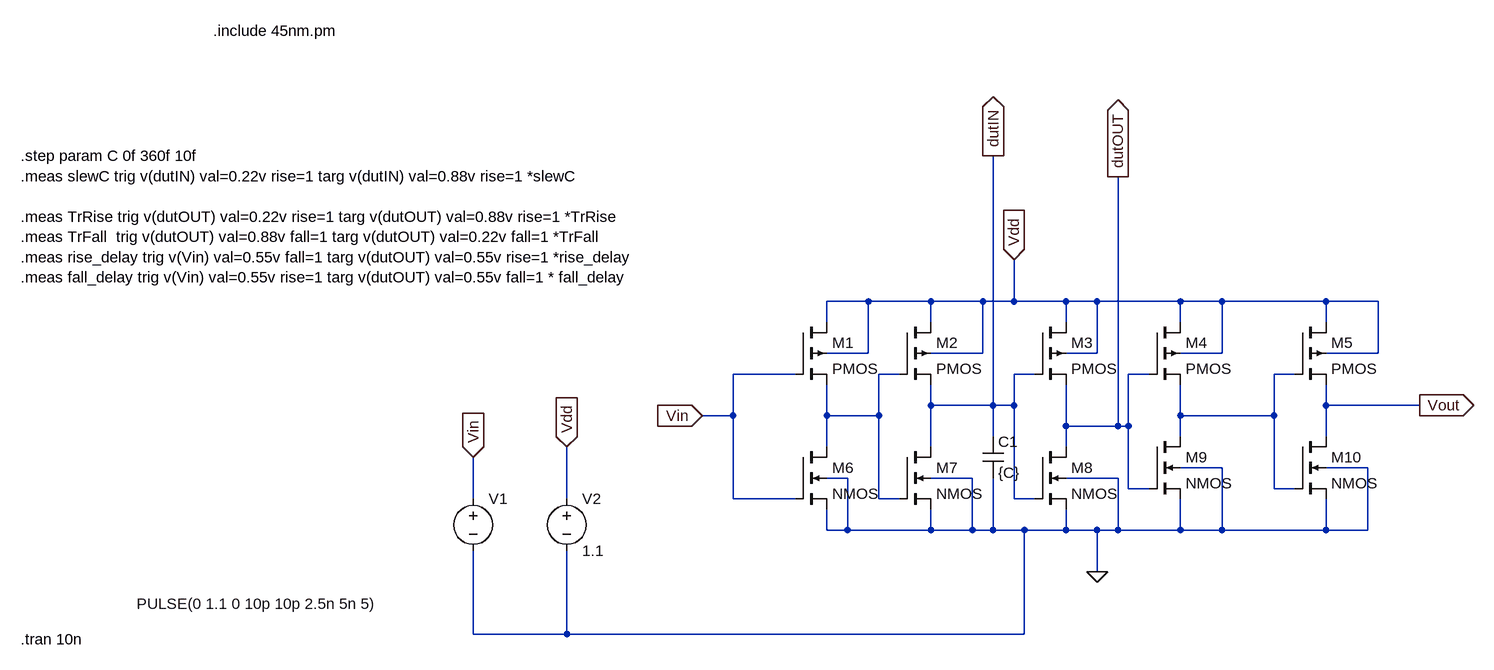
[diagram p0: schematic hw-2-1.asc]
hw-2-1.asc, the LTspice schematic file:
Version 4
SHEET 1 1536 1020
WIRE 576 480 512 480
WIRE 672 480 576 480
WIRE 752 480 672 480
WIRE 800 480 800 416
WIRE 800 480 752 480
WIRE 880 480 800 480
WIRE 928 480 880 480
WIRE 1056 480 928 480
WIRE 1120 480 1056 480
WIRE 1280 480 1120 480
WIRE 1360 480 1280 480
WIRE 512 512 512 480
WIRE 672 512 672 480
WIRE 880 512 880 480
WIRE 1056 512 1056 480
WIRE 1280 512 1280 480
WIRE 576 560 576 480
WIRE 576 560 512 560
WIRE 752 560 752 480
WIRE 752 560 672 560
WIRE 928 560 928 480
WIRE 928 560 880 560
WIRE 1120 560 1120 480
WIRE 1120 560 1056 560
WIRE 1360 560 1360 480
WIRE 1360 560 1280 560
WIRE 464 592 368 592
WIRE 624 592 592 592
WIRE 832 592 800 592
WIRE 1008 592 976 592
WIRE 1232 592 1200 592
WIRE 672 640 672 608
WIRE 768 640 768 256
WIRE 768 640 672 640
WIRE 800 640 800 592
WIRE 800 640 768 640
WIRE 1280 640 1280 608
WIRE 1424 640 1280 640
WIRE 368 656 368 592
WIRE 368 656 320 656
WIRE 512 656 512 608
WIRE 592 656 592 592
WIRE 592 656 512 656
WIRE 1056 656 1056 608
WIRE 1200 656 1200 592
WIRE 1200 656 1056 656
WIRE 880 672 880 608
WIRE 960 672 960 288
WIRE 960 672 880 672
WIRE 976 672 976 592
WIRE 976 672 960 672
WIRE 768 688 768 640
WIRE 1056 688 1056 656
WIRE 1280 688 1280 640
WIRE 512 704 512 656
WIRE 672 704 672 640
WIRE 880 704 880 672
WIRE 1120 736 1056 736
WIRE 1344 736 1280 736
WIRE 544 752 512 752
WIRE 736 752 672 752
WIRE 960 752 880 752
WIRE 976 768 976 672
WIRE 1008 768 976 768
WIRE 1200 768 1200 656
WIRE 1232 768 1200 768
WIRE -32 784 -32 720
WIRE 112 784 112 704
WIRE 368 784 368 656
WIRE 464 784 368 784
WIRE 592 784 592 656
WIRE 624 784 592 784
WIRE 800 784 800 640
WIRE 832 784 800 784
WIRE 512 832 512 800
WIRE 544 832 544 752
WIRE 544 832 512 832
WIRE 672 832 672 800
WIRE 672 832 544 832
WIRE 736 832 736 752
WIRE 736 832 672 832
WIRE 768 832 768 752
WIRE 768 832 736 832
WIRE 816 832 768 832
WIRE 880 832 880 800
WIRE 880 832 816 832
WIRE 928 832 880 832
WIRE 960 832 960 752
WIRE 960 832 928 832
WIRE 1056 832 1056 784
WIRE 1056 832 960 832
WIRE 1120 832 1120 736
WIRE 1120 832 1056 832
WIRE 1280 832 1280 784
WIRE 1280 832 1120 832
WIRE 1344 832 1344 736
WIRE 1344 832 1280 832
WIRE 928 896 928 832
WIRE -32 992 -32 864
WIRE 112 992 112 864
WIRE 112 992 -32 992
WIRE 816 992 816 832
WIRE 816 992 112 992
FLAG 800 416 Vdd
IOPIN 800 416 In
FLAG 320 656 Vin
IOPIN 320 656 In
FLAG 928 896 0
FLAG 1424 640 Vout
IOPIN 1424 640 Out
FLAG -32 720 Vin
IOPIN -32 720 In
FLAG 112 704 Vdd
IOPIN 112 704 In
FLAG 768 256 dutIN
IOPIN 768 256 Out
FLAG 960 288 dutOUT
IOPIN 960 288 Out
SYMBOL pmos4 464 512 R0
SYMATTR InstName M1
SYMATTR Value2 l=45n w=0.296u
SYMBOL pmos4 624 512 R0
SYMATTR InstName M2
SYMATTR Value2 l=45n w=0.296u m=4
SYMBOL pmos4 832 512 R0
SYMATTR InstName M3
SYMATTR Value2 l=45n w=0.296u m=16
SYMBOL pmos4 1008 512 R0
SYMATTR InstName M4
SYMATTR Value2 l=45n w=0.296u m=64
SYMBOL pmos4 1232 512 R0
SYMATTR InstName M5
SYMATTR Value2 l=45n w=0.296u m=256
SYMBOL nmos4 464 704 R0
SYMATTR InstName M6
SYMATTR Value2 l=45n w=0.2u
SYMBOL nmos4 624 704 R0
SYMATTR InstName M7
SYMATTR Value2 l=45n w=0.2u m=4
SYMBOL nmos4 832 704 R0
SYMATTR InstName M8
SYMATTR Value2 l=45n w=0.2u m=16
SYMBOL nmos4 1008 688 R0
SYMATTR InstName M9
SYMATTR Value2 l=45n w=0.2u m=64
SYMBOL nmos4 1232 688 R0
SYMATTR InstName M10
SYMATTR Value2 l=45n w=0.2u m=256
SYMBOL voltage -32 768 R0
WINDOW 123 0 0 Left 0
WINDOW 39 0 0 Left 0
WINDOW 3 -518 177 Left 2
SYMATTR Value PULSE(0 1.1 0 10p 10p 2.5n 5n 5)
SYMATTR InstName V1
SYMBOL voltage 112 768 R0
WINDOW 123 0 0 Left 0
WINDOW 39 0 0 Left 0
SYMATTR InstName V2
SYMATTR Value 1.1
SYMBOL cap 752 688 R0
SYMATTR InstName C1
SYMATTR Value {C}
TEXT -432 64 Left 2 !.include 45nm.pm
TEXT -728 256 Left 2 !.step param C 0f 360f 10f\n.meas slewC trig v(dutIN) val=0.22v rise=1 targ v(dutIN) val=0.88v rise=1 *slewC\n \n.meas TrRise trig v(dutOUT) val=0.22v rise=1 targ v(dutOUT) val=0.88v rise=1 *TrRise\n.meas TrFall  trig v(dutOUT) val=0.88v fall=1 targ v(dutOUT) val=0.22v fall=1 *TrFall\n.meas rise_delay trig v(Vin) val=0.55v fall=1 targ v(dutOUT) val=0.55v rise=1 *rise_delay\n.meas fall_delay trig v(Vin) val=0.55v rise=1 targ v(dutOUT) val=0.55v fall=1 * fall_delay
TEXT -728 1000 Left 2 !.tran 10n

The netlist it stands for:
* hw-2-1.asc
M1 Vdd Vin N001 Vdd PMOS l=45n w=0.296u
M2 Vdd N001 dutIN Vdd PMOS l=45n w=0.296u m=4
M3 Vdd dutIN dutOUT Vdd PMOS l=45n w=0.296u m=16
M4 Vdd dutOUT N002 Vdd PMOS l=45n w=0.296u m=64
M5 Vdd N002 Vout Vdd PMOS l=45n w=0.296u m=256
M6 N001 Vin 0 0 NMOS l=45n w=0.2u
M7 dutIN N001 0 0 NMOS l=45n w=0.2u m=4
M8 dutOUT dutIN 0 0 NMOS l=45n w=0.2u m=16
M9 N002 dutOUT 0 0 NMOS l=45n w=0.2u m=64
M10 Vout N002 0 0 NMOS l=45n w=0.2u m=256
V1 Vin 0 PULSE(0 1.1 0 10p 10p 2.5n 5n 5)
V2 Vdd 0 1.1
C1 dutIN 0 {C}
.model NMOS NMOS
.model PMOS PMOS
.lib standard.mos
.include 45nm.pm
.step param C 0f 360f 10f
.meas slewC trig v(dutIN) val=0.22v rise=1 targ v(dutIN) val=0.88v rise=1 *slewC
.meas TrRise trig v(dutOUT) val=0.22v rise=1 targ v(dutOUT) val=0.88v rise=1 *TrRise
.meas TrFall  trig v(dutOUT) val=0.88v fall=1 targ v(dutOUT) val=0.22v fall=1 *TrFall
.meas rise_delay trig v(Vin) val=0.55v fall=1 targ v(dutOUT) val=0.55v rise=1 *rise_delay
.meas fall_delay trig v(Vin) val=0.55v rise=1 targ v(dutOUT) val=0.55v fall=1 * fall_delay
.tran 10n
.backanno
.end